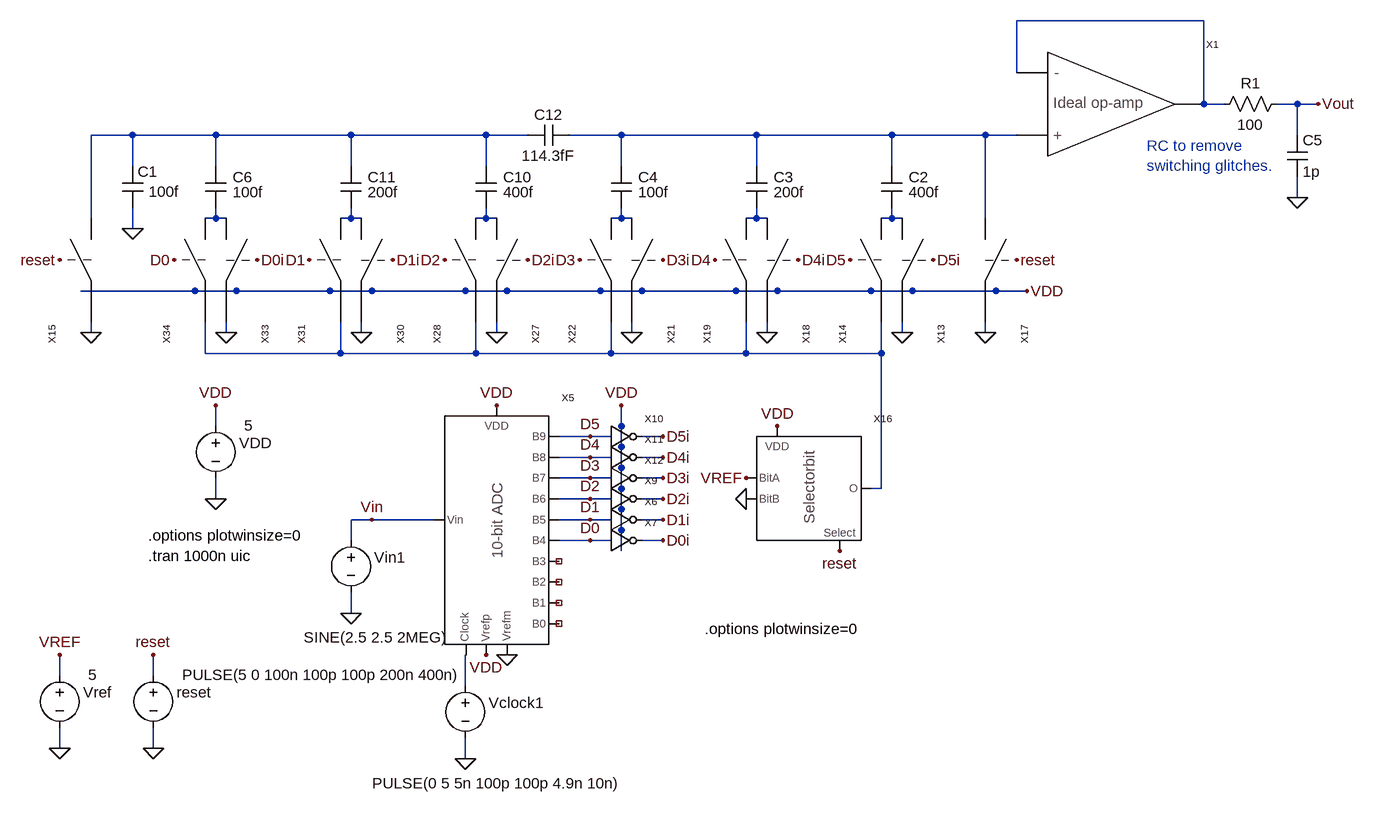
[diagram p0: schematic Fig29_15.asc]
Fig29_15.asc, the LTspice schematic file:
Version 4
SHEET 1 2492 2408
WIRE 2080 848 1792 848
WIRE 1792 928 1792 848
WIRE 2080 976 2080 848
WIRE 2112 976 2080 976
WIRE 2224 976 2192 976
WIRE 2256 976 2224 976
WIRE 432 1024 368 1024
WIRE 560 1024 432 1024
WIRE 768 1024 560 1024
WIRE 976 1024 768 1024
WIRE 1040 1024 976 1024
WIRE 1184 1024 1104 1024
WIRE 1392 1024 1184 1024
WIRE 1600 1024 1392 1024
WIRE 1744 1024 1600 1024
WIRE 1792 1024 1744 1024
WIRE 2224 1024 2224 976
WIRE 432 1072 432 1024
WIRE 560 1072 560 1024
WIRE 768 1072 768 1024
WIRE 976 1072 976 1024
WIRE 1184 1072 1184 1024
WIRE 1392 1072 1392 1024
WIRE 1600 1072 1600 1024
WIRE 2224 1120 2224 1088
WIRE 368 1152 368 1024
WIRE 560 1152 560 1136
WIRE 560 1152 544 1152
WIRE 576 1152 560 1152
WIRE 768 1152 768 1136
WIRE 768 1152 752 1152
WIRE 784 1152 768 1152
WIRE 976 1152 976 1136
WIRE 976 1152 960 1152
WIRE 992 1152 976 1152
WIRE 1184 1152 1184 1136
WIRE 1184 1152 1168 1152
WIRE 1200 1152 1184 1152
WIRE 1392 1152 1392 1136
WIRE 1392 1152 1376 1152
WIRE 1408 1152 1392 1152
WIRE 1600 1152 1600 1136
WIRE 1600 1152 1584 1152
WIRE 1616 1152 1600 1152
WIRE 1744 1152 1744 1024
WIRE 432 1168 432 1136
WIRE 528 1264 352 1264
WIRE 592 1264 528 1264
WIRE 736 1264 592 1264
WIRE 800 1264 736 1264
WIRE 944 1264 800 1264
WIRE 1008 1264 944 1264
WIRE 1152 1264 1008 1264
WIRE 1216 1264 1152 1264
WIRE 1360 1264 1216 1264
WIRE 1424 1264 1360 1264
WIRE 1568 1264 1424 1264
WIRE 1632 1264 1568 1264
WIRE 1760 1264 1632 1264
WIRE 1808 1264 1760 1264
WIRE 368 1328 368 1312
WIRE 576 1328 576 1312
WIRE 784 1328 784 1312
WIRE 992 1328 992 1312
WIRE 1200 1328 1200 1312
WIRE 1408 1328 1408 1312
WIRE 1616 1328 1616 1312
WIRE 1744 1328 1744 1312
WIRE 544 1360 544 1312
WIRE 752 1360 752 1312
WIRE 752 1360 544 1360
WIRE 960 1360 960 1312
WIRE 960 1360 752 1360
WIRE 1168 1360 1168 1312
WIRE 1168 1360 960 1360
WIRE 1376 1360 1376 1312
WIRE 1376 1360 1168 1360
WIRE 1584 1360 1584 1312
WIRE 1584 1360 1376 1360
WIRE 560 1472 560 1440
WIRE 1184 1472 1184 1440
WIRE 1136 1488 1088 1488
WIRE 1168 1488 1136 1488
WIRE 1248 1488 1216 1488
WIRE 1184 1504 1184 1472
WIRE 1136 1520 1088 1520
WIRE 1168 1520 1136 1520
WIRE 1248 1520 1216 1520
WIRE 1184 1536 1184 1504
WIRE 1136 1552 1088 1552
WIRE 1168 1552 1136 1552
WIRE 1248 1552 1216 1552
WIRE 1184 1568 1184 1536
WIRE 1584 1568 1584 1360
WIRE 1584 1568 1568 1568
WIRE 560 1584 560 1552
WIRE 1136 1584 1088 1584
WIRE 1168 1584 1136 1584
WIRE 1248 1584 1216 1584
WIRE 1184 1600 1184 1568
WIRE 800 1616 768 1616
WIRE 896 1616 800 1616
WIRE 1136 1616 1088 1616
WIRE 1168 1616 1136 1616
WIRE 1248 1616 1216 1616
WIRE 1184 1632 1184 1600
WIRE 768 1648 768 1616
WIRE 1136 1648 1088 1648
WIRE 1168 1648 1136 1648
WIRE 1248 1648 1216 1648
WIRE 1184 1664 1184 1632
WIRE 768 1760 768 1728
WIRE 320 1856 320 1824
WIRE 464 1856 464 1824
WIRE 944 1872 944 1824
WIRE 320 1968 320 1936
WIRE 464 1968 464 1936
WIRE 944 1984 944 1952
FLAG 560 1584 0
FLAG 560 1440 VDD
FLAG 992 1440 VDD
FLAG 944 1984 0
FLAG 1008 1824 0
FLAG 976 1824 VDD
FLAG 768 1760 0
FLAG 800 1616 Vin
FLAG 432 1168 0
FLAG 2256 976 Vout
FLAG 1136 1648 D0
FLAG 1136 1616 D1
FLAG 1248 1616 D1i
FLAG 1248 1648 D0i
FLAG 1136 1584 D2
FLAG 1248 1584 D2i
FLAG 1136 1552 D3
FLAG 1136 1520 D4
FLAG 1136 1488 D5
FLAG 1184 1440 VDD
FLAG 1248 1488 D5i
FLAG 1248 1520 D4i
FLAG 1248 1552 D3i
FLAG 1536 1216 D5
FLAG 1664 1216 D5i
FLAG 1616 1328 0
FLAG 1328 1216 D4
FLAG 1456 1216 D4i
FLAG 1408 1328 0
FLAG 1120 1216 D3
FLAG 1248 1216 D3i
FLAG 1200 1328 0
FLAG 912 1216 D2
FLAG 1040 1216 D2i
FLAG 992 1328 0
FLAG 704 1216 D1
FLAG 832 1216 D1i
FLAG 784 1328 0
FLAG 496 1216 D0
FLAG 624 1216 D0i
FLAG 576 1328 0
FLAG 1808 1264 VDD
FLAG 368 1328 0
FLAG 320 1216 reset
FLAG 1424 1472 VDD
FLAG 1520 1664 reset
FLAG 1376 1584 0
FLAG 1376 1552 VREF
FLAG 320 1968 0
FLAG 320 1824 VREF
FLAG 464 1968 0
FLAG 464 1824 reset
FLAG 1744 1328 0
FLAG 1792 1216 reset
FLAG 2224 1120 0
SYMBOL voltage 560 1456 R0
WINDOW 0 36 42 Left 0
WINDOW 3 44 15 Left 0
WINDOW 123 0 0 Left 0
WINDOW 39 0 0 Left 0
SYMATTR InstName VDD
SYMATTR Value 5
SYMBOL voltage 944 1856 R0
WINDOW 0 36 42 Left 0
WINDOW 3 -143 166 Left 0
WINDOW 123 0 0 Left 0
WINDOW 39 0 0 Left 0
SYMATTR InstName Vclock1
SYMATTR Value PULSE(0 5 5n 100p 100p 4.9n 10n)
SYMBOL voltage 768 1632 R0
WINDOW 0 36 42 Left 0
WINDOW 3 -73 165 Left 0
WINDOW 123 0 0 Left 0
WINDOW 39 0 0 Left 0
SYMATTR InstName Vin1
SYMATTR Value SINE(2.5 2.5 2MEG)
SYMBOL Ideal_op_amp 1840 976 R0
SYMATTR InstName X1
SYMBOL Ideal_10_bit_ADC 912 1808 R0
SYMATTR InstName X5
SYMBOL inverter 1168 1616 R0
SYMATTR InstName X6
SYMBOL inverter 1168 1648 R0
SYMATTR InstName X7
SYMBOL inverter 1168 1584 R0
SYMATTR InstName X9
SYMBOL inverter 1168 1488 R0
SYMATTR InstName X10
SYMBOL inverter 1168 1520 R0
SYMATTR InstName X11
SYMBOL inverter 1168 1552 R0
SYMATTR InstName X12
SYMBOL switch_1 1600 1152 R90
SYMATTR InstName X13
SYMBOL switch_1 1600 1152 M90
SYMATTR InstName X14
SYMBOL switch_1 1392 1152 R90
SYMATTR InstName X18
SYMBOL switch_1 1392 1152 M90
SYMATTR InstName X19
SYMBOL switch_1 1184 1152 R90
SYMATTR InstName X21
SYMBOL switch_1 1184 1152 M90
SYMATTR InstName X22
SYMBOL switch_1 976 1152 R90
SYMATTR InstName X27
SYMBOL switch_1 976 1152 M90
SYMATTR InstName X28
SYMBOL switch_1 768 1152 R90
SYMATTR InstName X30
SYMBOL switch_1 768 1152 M90
SYMATTR InstName X31
SYMBOL switch_1 560 1152 R90
SYMATTR InstName X33
SYMBOL switch_1 560 1152 M90
SYMATTR InstName X34
SYMBOL cap 416 1072 R0
WINDOW 3 41 39 Left 0
SYMATTR Value 100f
SYMATTR InstName C1
SYMBOL cap 1584 1072 R0
WINDOW 0 42 17 Left 0
WINDOW 3 42 40 Left 0
SYMATTR InstName C2
SYMATTR Value 400f
SYMBOL cap 1376 1072 R0
WINDOW 0 42 17 Left 0
WINDOW 3 42 40 Left 0
SYMATTR InstName C3
SYMATTR Value 200f
SYMBOL cap 1168 1072 R0
WINDOW 0 42 17 Left 0
WINDOW 3 42 40 Left 0
SYMATTR InstName C4
SYMATTR Value 100f
SYMBOL cap 544 1072 R0
WINDOW 0 42 17 Left 0
WINDOW 3 42 40 Left 0
SYMATTR InstName C6
SYMATTR Value 100f
SYMBOL cap 960 1072 R0
WINDOW 0 42 17 Left 0
WINDOW 3 42 40 Left 0
SYMATTR InstName C10
SYMATTR Value 400f
SYMBOL cap 752 1072 R0
WINDOW 0 42 17 Left 0
WINDOW 3 42 40 Left 0
SYMATTR InstName C11
SYMATTR Value 200f
SYMBOL switch_1 384 1152 M90
SYMATTR InstName X15
SYMBOL Selectorbit 1392 1648 R0
SYMATTR InstName X16
SYMBOL voltage 320 1840 R0
WINDOW 0 36 42 Left 0
WINDOW 3 44 15 Left 0
WINDOW 123 0 0 Left 0
WINDOW 39 0 0 Left 0
SYMATTR InstName Vref
SYMATTR Value 5
SYMBOL voltage 464 1840 R0
WINDOW 0 36 42 Left 0
WINDOW 3 44 15 Left 0
WINDOW 123 0 0 Left 0
WINDOW 39 0 0 Left 0
SYMATTR InstName reset
SYMATTR Value PULSE(5 0 100n 100p 100p 200n 400n)
SYMBOL cap 1040 1040 R270
WINDOW 0 32 32 VTop 0
WINDOW 3 0 32 VBottom 0
SYMATTR InstName C12
SYMATTR Value 114.3fF
SYMBOL switch_1 1728 1152 R90
SYMATTR InstName X17
SYMBOL res 2096 992 R270
WINDOW 0 32 56 VTop 0
WINDOW 3 0 56 VBottom 0
SYMATTR InstName R1
SYMATTR Value 100
SYMBOL cap 2208 1024 R0
SYMATTR InstName C5
SYMATTR Value 1p
TEXT 456 1672 Left 0 !.tran 1000n uic
TEXT 456 1640 Left 0 !.options plotwinsize=0
TEXT 1992 1040 Left 0 ;RC to remove\nswitching glitches.
TEXT 1312 1784 Left 0 !.options plotwinsize=0

The netlist it stands for:
* Fig29_15.asc
VDD VDD 0 5
Vclock1 N011 0 PULSE(0 5 5n 100p 100p 4.9n 10n)
Vin1 Vin 0 SINE(2.5 2.5 2MEG)
XX1 N001 N003 N001 Ideal_op_amp  ; pins Vinm Vinp Out
XX5 NC_01 NC_02 NC_03 NC_04 D0 D1 D2 D3 D4 D5 Vin VDD 0 N011 VDD Ideal_10_bit_ADC  ; pins B0 B1 B2 B3 B4 B5 B6 B7 B8 B9 Vin Vrefp Vrefm Clock VDD
XX6 D1 D1i VDD inverter  ; pins In Out VDD
XX7 D0 D0i VDD inverter  ; pins In Out VDD
XX9 D2 D2i VDD inverter  ; pins In Out VDD
XX10 D5 D5i VDD inverter  ; pins In Out VDD
XX11 D4 D4i VDD inverter  ; pins In Out VDD
XX12 D3 D3i VDD inverter  ; pins In Out VDD
XX13 N009 0 D5i VDD switch_1  ; pins P1 P2 clk VDD
XX14 N009 N010 D5 VDD switch_1  ; pins P1 P2 clk VDD
XX18 N008 0 D4i VDD switch_1  ; pins P1 P2 clk VDD
XX19 N008 N010 D4 VDD switch_1  ; pins P1 P2 clk VDD
XX21 N007 0 D3i VDD switch_1  ; pins P1 P2 clk VDD
XX22 N007 N010 D3 VDD switch_1  ; pins P1 P2 clk VDD
XX27 N006 0 D2i VDD switch_1  ; pins P1 P2 clk VDD
XX28 N006 N010 D2 VDD switch_1  ; pins P1 P2 clk VDD
XX30 N005 0 D1i VDD switch_1  ; pins P1 P2 clk VDD
XX31 N005 N010 D1 VDD switch_1  ; pins P1 P2 clk VDD
XX33 N004 0 D0i VDD switch_1  ; pins P1 P2 clk VDD
XX34 N004 N010 D0 VDD switch_1  ; pins P1 P2 clk VDD
C1 N002 0 100f
C2 N003 N009 400f
C3 N003 N008 200f
C4 N003 N007 100f
C6 N002 N004 100f
C10 N002 N006 400f
C11 N002 N005 200f
XX15 N002 0 reset VDD switch_1  ; pins P1 P2 clk VDD
XX16 VREF 0 N010 reset VDD Selectorbit  ; pins BitA BitB O Select VDD
Vref VREF 0 5
V§reset reset 0 PULSE(5 0 100n 100p 100p 200n 400n)
C12 N002 N003 114.3fF
XX17 N003 0 reset VDD switch_1  ; pins P1 P2 clk VDD
R1 N001 Vout 100
C5 Vout 0 1p
.tran 1000n uic
.options plotwinsize=0
* RC to remove
* switching glitches.
.options plotwinsize=0
.backanno
.end